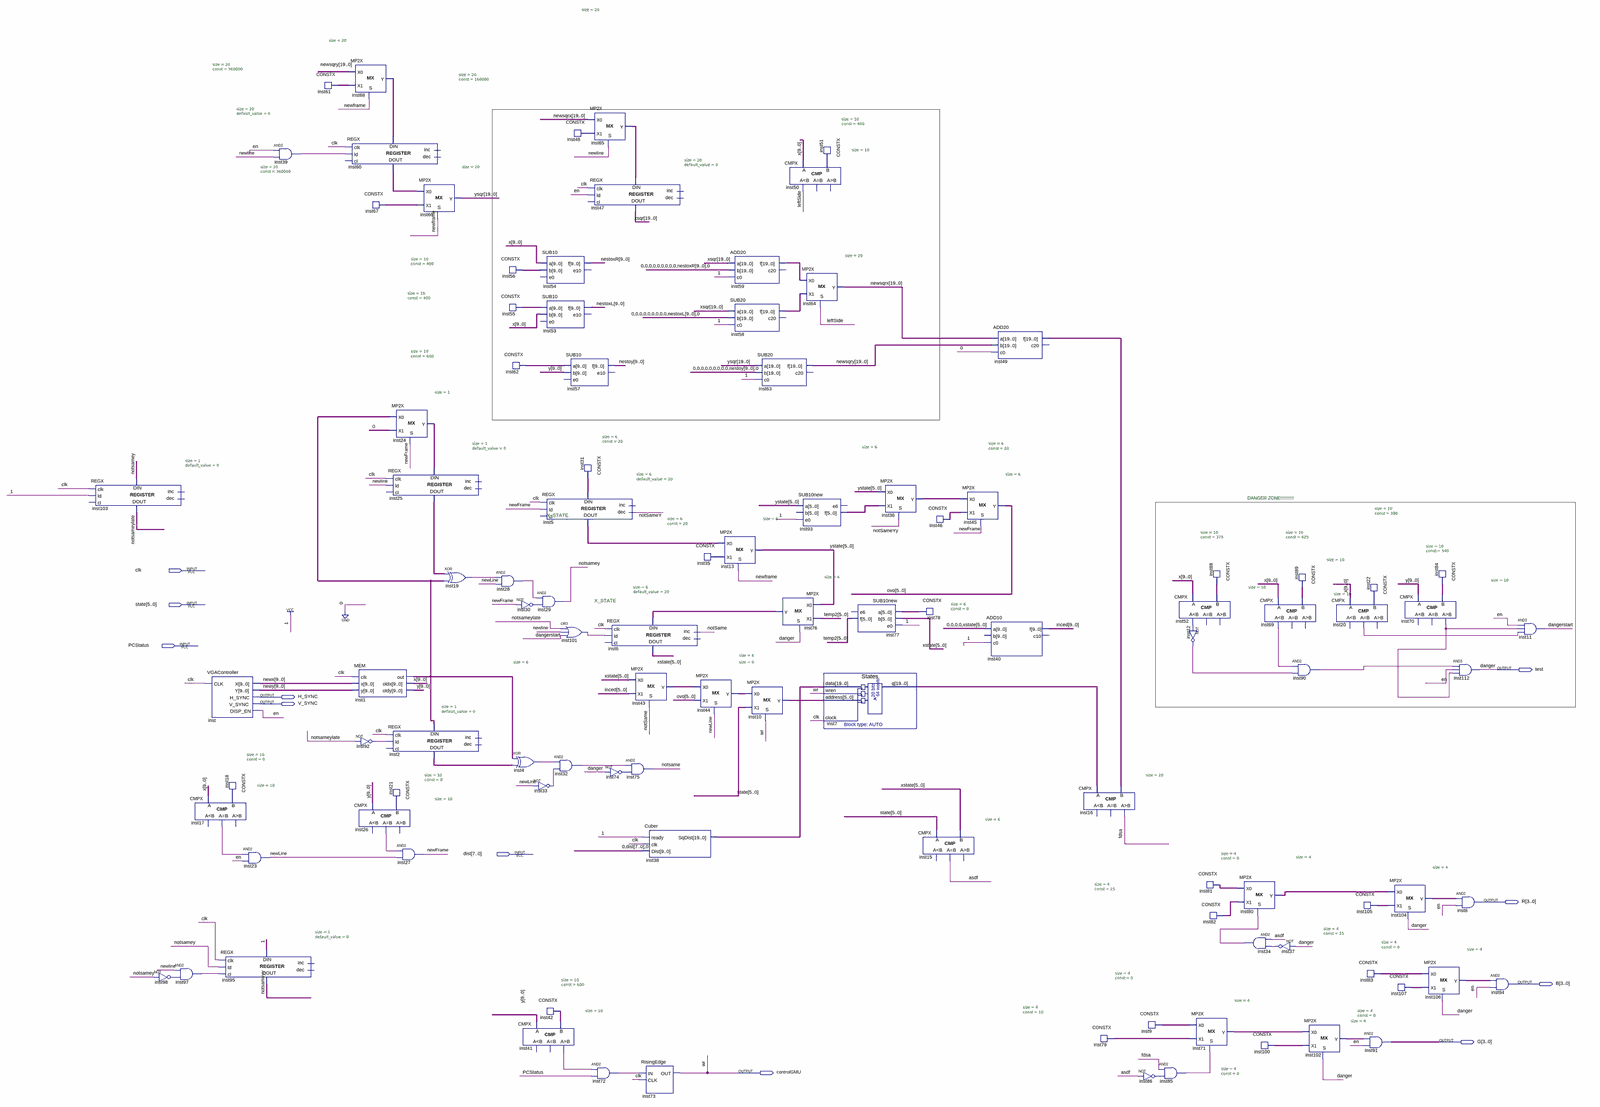
[diagram p0: schematic sheet, whole]
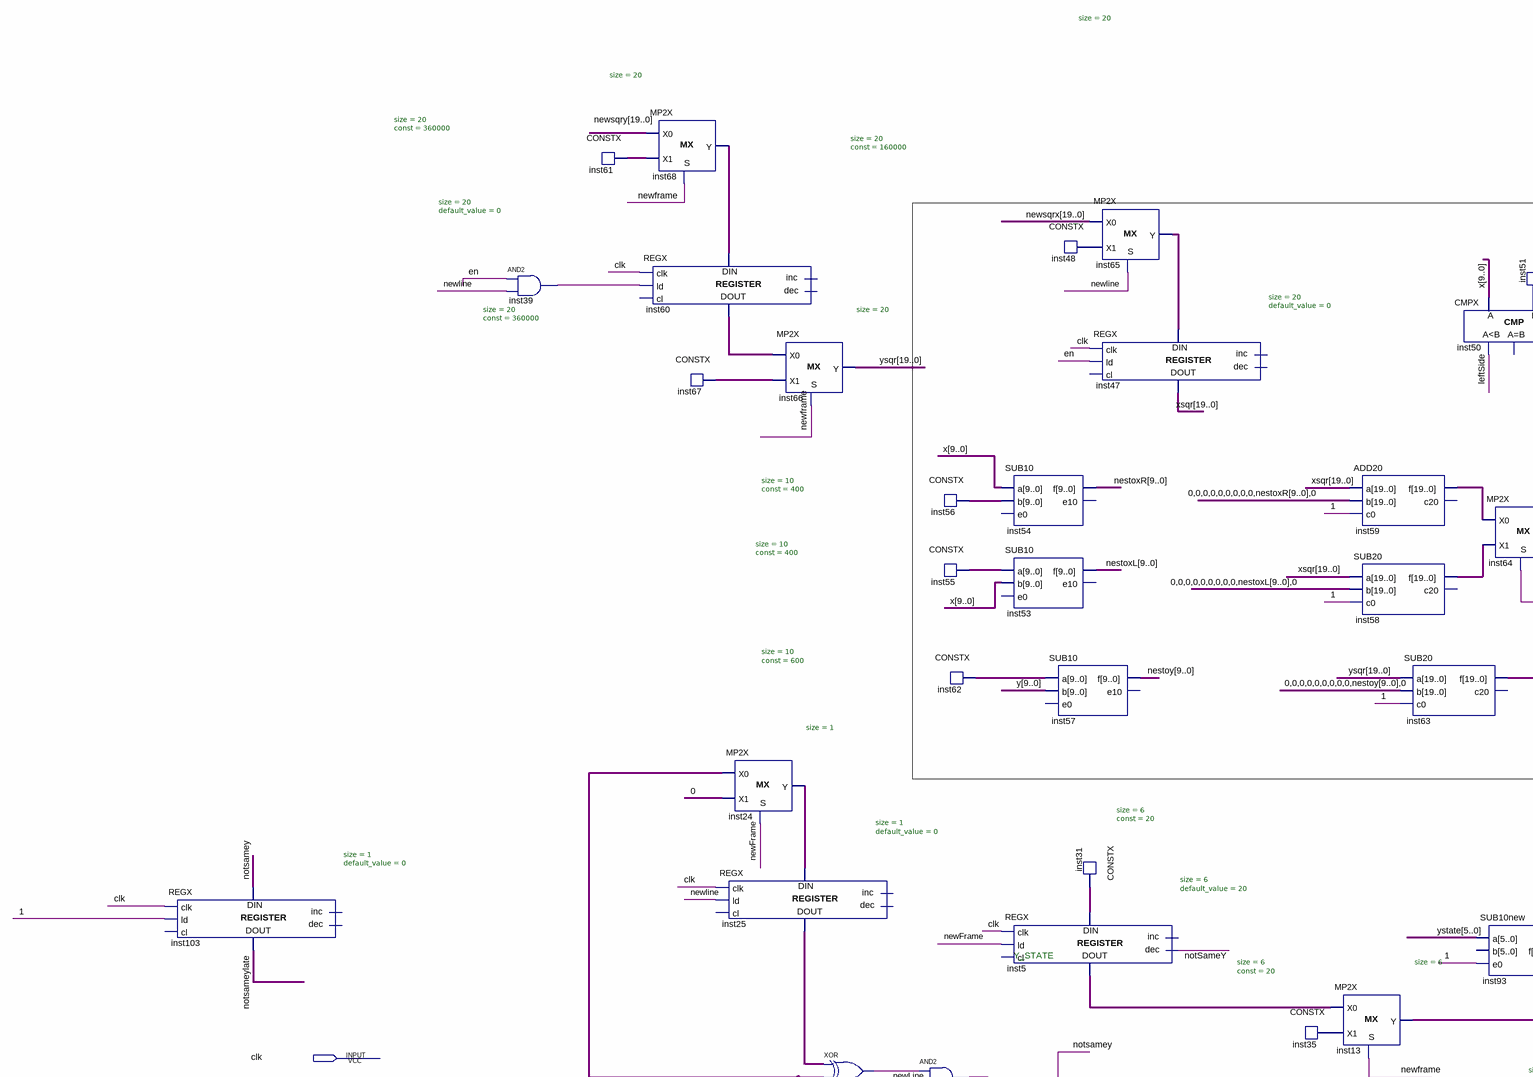
[diagram p1: schematic sheet, upper left part]
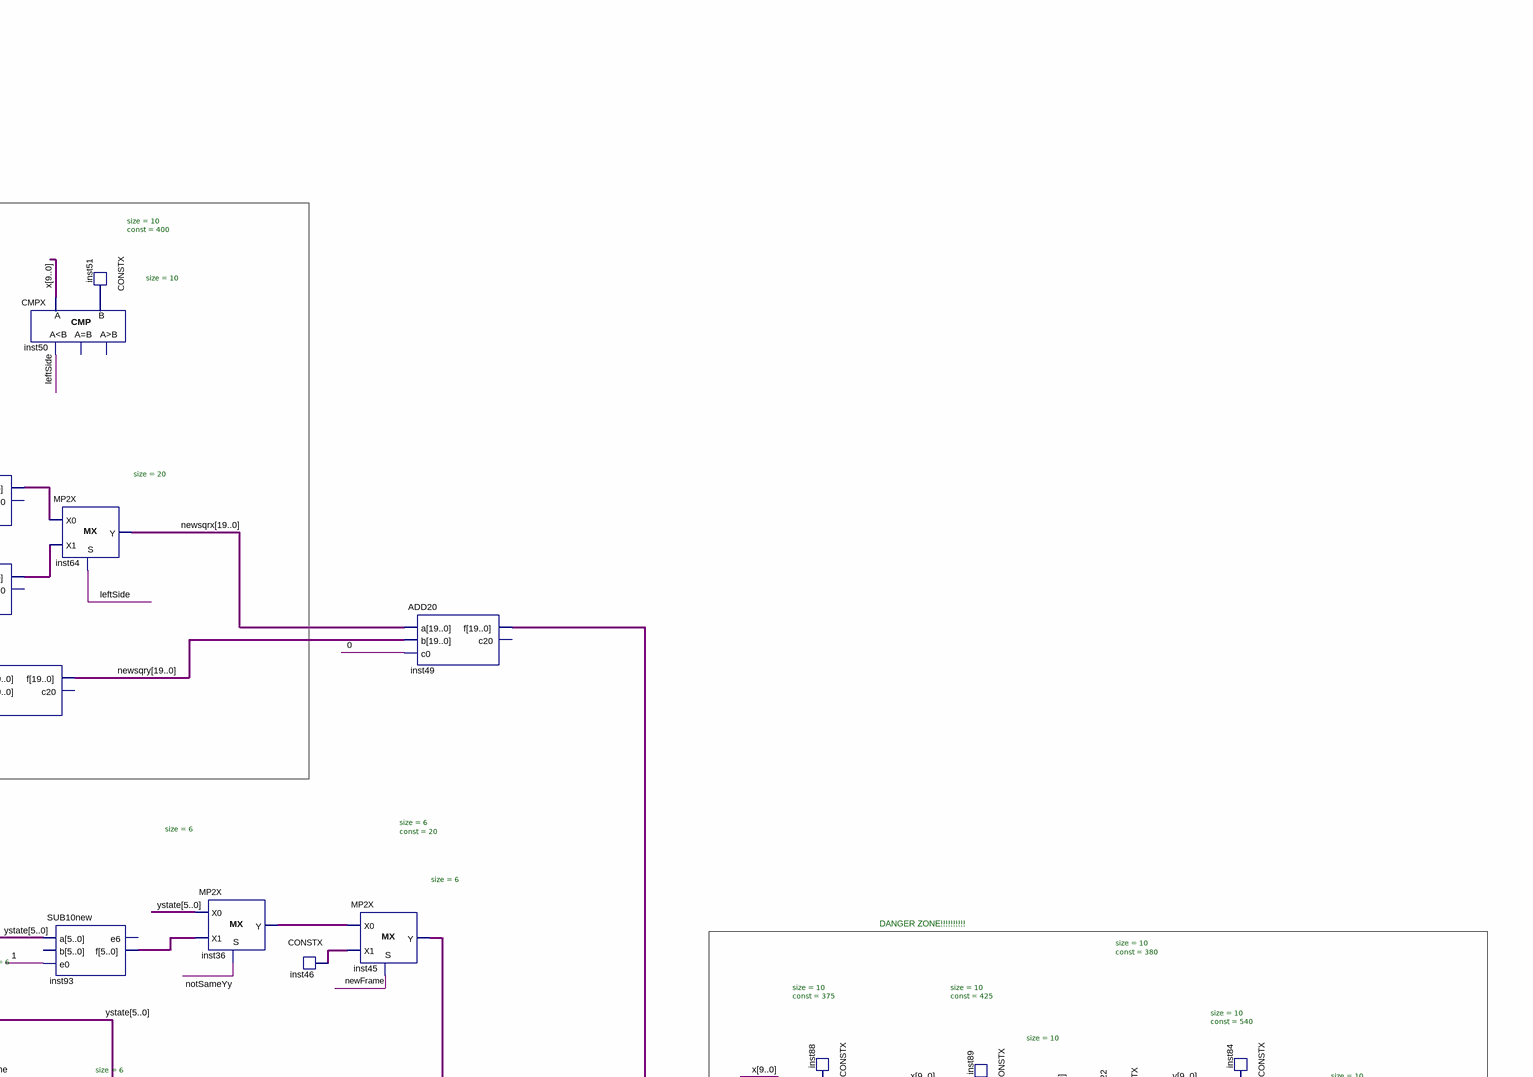
[diagram p2: schematic sheet, upper right part]
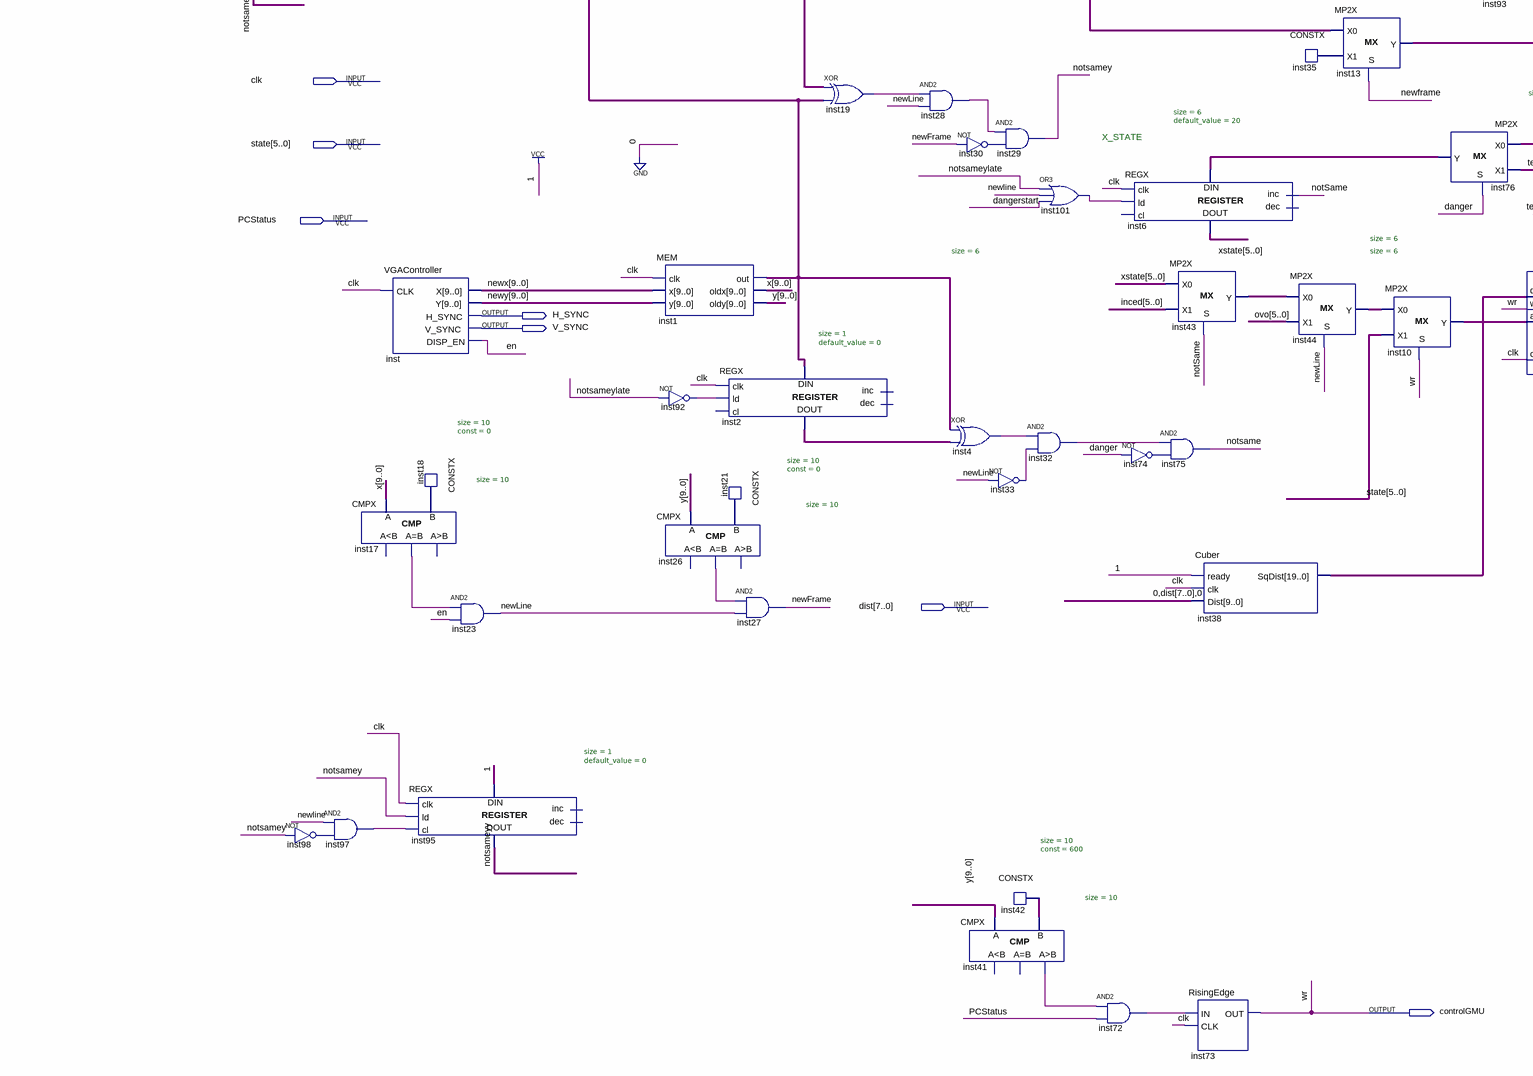
[diagram p3: schematic sheet, lower left part]
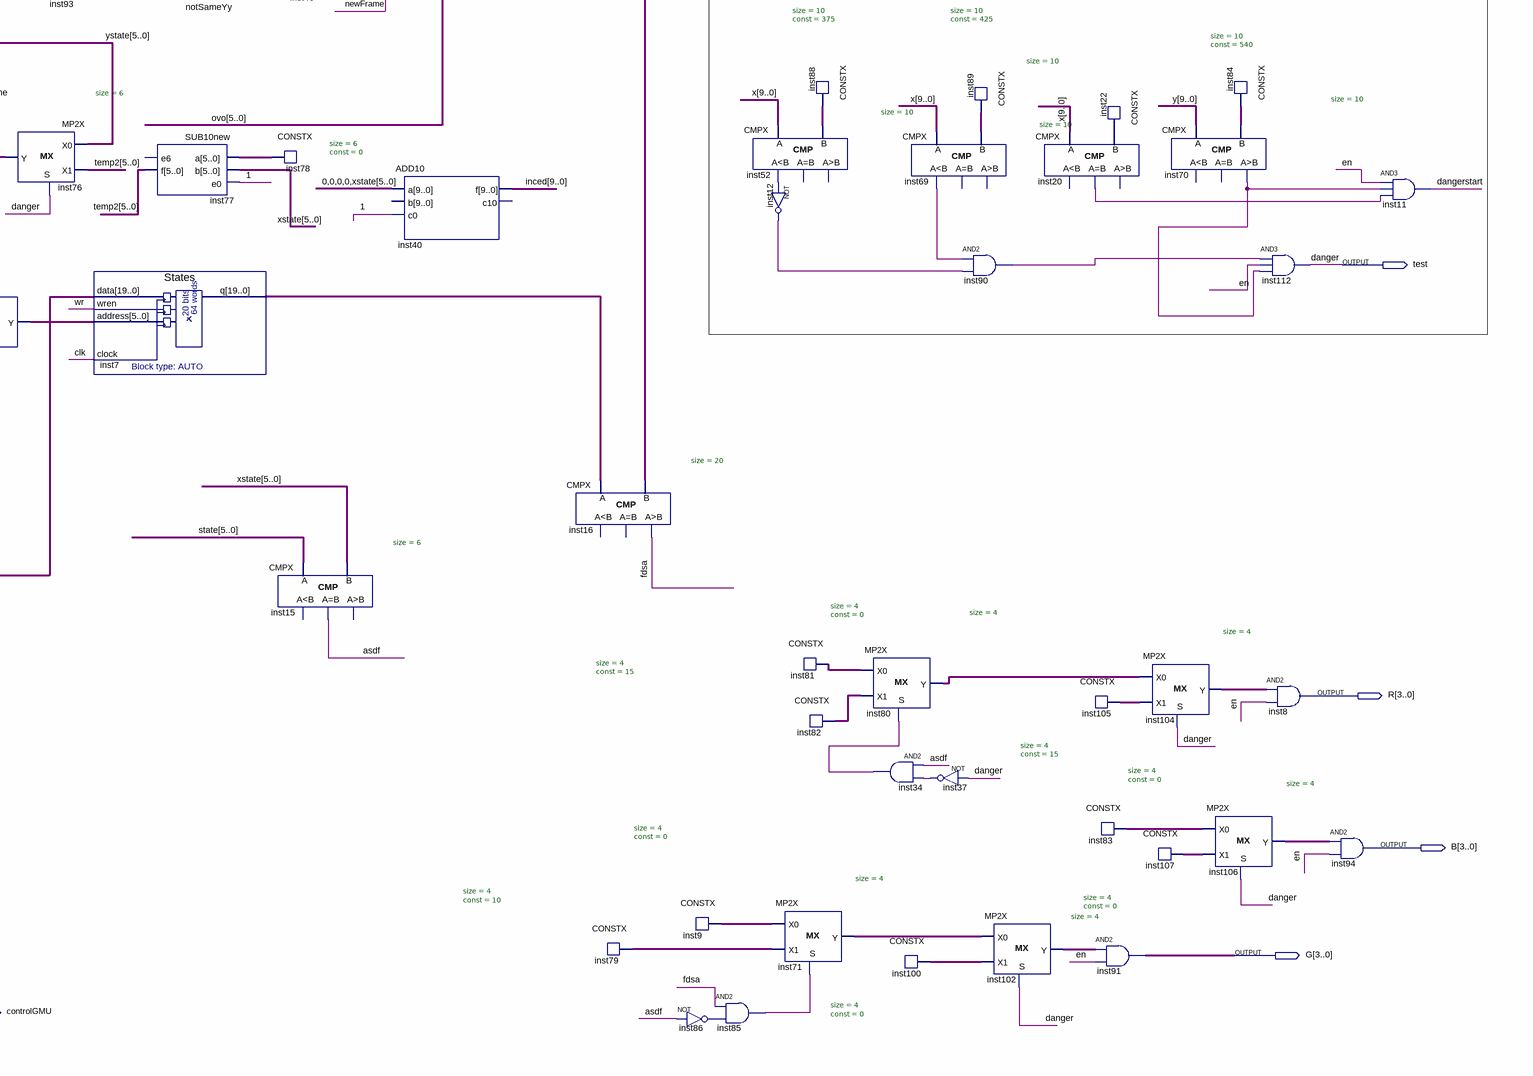
[diagram p4: schematic sheet, lower right part]
// Quartus schematic GMU.bdf as structural Verilog: 104 symbols, 11 pins
module GMU (
  input  clk,
  input  [5:0] state,
  input  PCStatus,
  input  [7:0] \dist ,
  output test,
  output H_SYNC,
  output V_SYNC,
  output [3:0] R,
  output [3:0] B,
  output [3:0] G,
  output controlGMU
);

  wire asdf, dangerstart, en, fdsa, inst1_out, inst2_data_out, inst4_out, inst12_out, inst17_eq, inst19_out,
       inst20_eq, inst24_y, inst25_data_out, inst26_eq, inst28_out, inst30_out, inst32_out, inst33_out,
       inst34_out, inst37_out, inst39_out, inst41_gr, inst52_ls, inst69_ls, inst70_gr, inst72_out,
       inst74_out, inst85_out, inst86_out, inst90_out, inst92_out, inst97_out, inst98_out, inst101_out,
       leftSide, newFrame, newLine, notsame, notsamey, notsameylate, notsameyy;
  wire [3:0] inst9_data, inst71_y, inst79_data, inst80_y, inst81_data, inst82_data, inst83_data,
       inst100_data, inst102_y, inst104_y, inst105_data, inst106_y, inst107_data;
  wire [5:0] inst5_data_out, inst10_y, inst31_data, inst35_data, inst36_y, inst43_y, inst44_y, inst46_data,
       inst76_y, inst78_data, inst93_f, ovo, temp2, xstate, ystate;
  wire [9:0] inced, inst18_data, inst21_data, inst22_data, inst42_data, inst51_data, inst55_data,
       inst56_data, inst62_data, inst84_data, inst88_data, inst89_data, nestoxL, nestoxR, nestoy, newx, newy,
       x, y;
  wire [19:0] inst7_q, inst38_sqdist, inst48_data, inst49_f, inst58_f, inst59_f, inst60_data_out,
       inst61_data, inst65_y, inst67_data, inst68_y, newsqrx, newsqry, xsqr, ysqr;

  REGX #(.size(1), .default_value(0)) inst103 (
    .clk(clk), .ld(1'b1), .data_in(notsamey), .data_out(notsameylate));  // open: cl, inc, dec
  and inst97 (inst97_out, newLine, inst98_out);
  not inst98 (inst98_out, notsamey);
  CMPX #(.size(10)) inst17 (.A(x), .B(inst18_data), .eq(inst17_eq));  // open: ls, gr
  VGAController inst (.CLK(clk), .X(newx), .Y(newy), .H_SYNC(H_SYNC), .V_SYNC(V_SYNC), .DISP_EN(en));
  CONSTX #(.size(10), .\const (0)) inst18 (.data(inst18_data));
  REGX #(.size(1), .default_value(0)) inst95 (
    .clk(clk), .ld(notsamey), .cl(inst97_out), .data_in(1'b1), .data_out(notsameyy));  // open: inc, dec
  and inst23 (newLine, inst17_eq, en);
  and inst39 (inst39_out, en, newLine);
  CONSTX #(.size(20), .\const (360000)) inst61 (.data(inst61_data));
  MP2X #(.size(20)) inst68 (.S(newFrame), .X0(newsqry), .X1(inst61_data), .Y(inst68_y));
  REGX #(.size(20), .default_value(0)) inst60 (
    .clk(clk), .ld(inst39_out), .data_in(inst68_y), .data_out(inst60_data_out));  // open: cl, inc, dec
  CONSTX #(.size(20), .\const (360000)) inst67 (.data(inst67_data));
  MEM inst1 (.clk(clk), .x(newx), .y(newy), .out(inst1_out), .oldx(x), .oldy(y));
  not inst92 (inst92_out, notsameylate);
  CMPX #(.size(10)) inst26 (.A(y), .B(inst21_data), .eq(inst26_eq));  // open: ls, gr
  MP2X #(.size(1)) inst24 (.S(newFrame), .X0(inst1_out), .X1(1'b0), .Y(inst24_y));
  REGX #(.size(1), .default_value(0)) inst25 (
    .clk(clk), .ld(newLine), .data_in(inst24_y), .data_out(inst25_data_out));  // open: cl, inc, dec
  REGX #(.size(1), .default_value(0)) inst2 (
    .clk(clk), .ld(inst92_out), .data_in(inst1_out), .data_out(inst2_data_out));  // open: cl, inc, dec
  CONSTX #(.size(10), .\const (0)) inst21 (.data(inst21_data));
  MP2X #(.size(20)) inst66 (.S(newFrame), .X0(inst60_data_out), .X1(inst67_data), .Y(ysqr));
  and inst27 (newFrame, inst26_eq, newLine);
  xor inst19 (inst19_out, inst25_data_out, inst1_out);
  CONSTX #(.size(10), .\const (400)) inst56 (.data(inst56_data));
  CONSTX #(.size(10), .\const (400)) inst55 (.data(inst55_data));
  CONSTX #(.size(10), .\const (600)) inst62 (.data(inst62_data));
  and inst28 (inst28_out, inst19_out, newLine);
  not inst30 (inst30_out, newFrame);
  xor inst4 (inst4_out, inst1_out, inst2_data_out);
  CMPX #(.size(10)) inst41 (.A(y), .B(inst42_data), .gr(inst41_gr));  // open: ls, eq
  SUB10 inst54 (.a(x), .b(inst56_data), .f(nestoxR));  // open: e0, e10
  SUB10 inst53 (.a(inst55_data), .b(x), .f(nestoxL));  // open: e0, e10
  REGX #(.size(6), .default_value(20)) inst5 (
    .clk(clk), .ld(newFrame), .dec(notsamey), .data_in(inst31_data), .data_out(inst5_data_out));  // open: cl, inc
  and inst29 (notsamey, inst28_out, inst30_out);
  and inst32 (inst32_out, inst4_out, inst33_out);
  not inst33 (inst33_out, newLine);
  CONSTX #(.size(10), .\const (600)) inst42 (.data(inst42_data));
  CONSTX #(.size(20), .\const (160000)) inst48 (.data(inst48_data));
  SUB10 inst57 (.a(inst62_data), .b(y), .f(nestoy));  // open: e0, e10
  CONSTX #(.size(6), .\const (20)) inst31 (.data(inst31_data));
  or inst101 (inst101_out, notsameylate, newLine, dangerstart);
  MP2X #(.size(20)) inst65 (.S(newLine), .X0(newsqrx), .X1(inst48_data), .Y(inst65_y));
  REGX #(.size(20), .default_value(0)) inst47 (
    .clk(clk), .ld(en), .data_in(inst65_y), .data_out(xsqr));  // open: cl, inc, dec
  REGX #(.size(6), .default_value(20)) inst6 (
    .clk(clk), .ld(inst101_out), .inc(notsame), .data_in(inst76_y), .data_out(xstate));  // open: cl, dec
  not inst74 (inst74_out, test);
  and inst72 (inst72_out, inst41_gr, PCStatus);
  MP2X #(.size(6)) inst43 (.S(notsame), .X0(xstate), .X1(inced[5:0]), .Y(inst43_y));
  and inst75 (notsame, inst32_out, inst74_out);
  RisingEdge inst73 (.IN(inst72_out), .CLK(clk), .OUT(controlGMU));
  Cuber inst38 (.ready(1'b1), .clk(clk), .Dist({1'b0, \dist , 1'b0}), .SqDist(inst38_sqdist));
  CONSTX #(.size(6), .\const (20)) inst35 (.data(inst35_data));
  MP2X #(.size(6)) inst44 (.S(newLine), .X0(inst43_y), .X1(ovo), .Y(inst44_y));
  MP2X #(.size(6)) inst13 (.S(newFrame), .X0(inst5_data_out), .X1(inst35_data), .Y(ystate));
  ADD20 inst59 (.a(xsqr), .b({{9{1'b0}}, nestoxR, 1'b0}), .c0(1'b1), .f(inst59_f));  // open: c20
  SUB20 inst58 (.a(xsqr), .b({{9{1'b0}}, nestoxL, 1'b0}), .c0(1'b1), .f(inst58_f));  // open: c20
  MP2X #(.size(6)) inst10 (.S(controlGMU), .X0(inst44_y), .X1(state), .Y(inst10_y));
  SUB20 inst63 (.a(ysqr), .b({{9{1'b0}}, nestoy, 1'b0}), .c0(1'b1), .f(newsqry));  // open: c20
  MP2X #(.size(6)) inst76 (.S(test), .X0(ystate), .X1(temp2), .Y(inst76_y));
  CMPX #(.size(10)) inst50 (.A(x), .B(inst51_data), .ls(leftSide));  // open: eq, gr
  MP2X #(.size(20)) inst64 (.S(leftSide), .X0(inst59_f), .X1(inst58_f), .Y(newsqrx));
  SUB10new inst93 (.a(ystate), .e0(1'b1), .f(inst93_f));  // open: b, e6
  CONSTX #(.size(10), .\const (400)) inst51 (.data(inst51_data));
  States inst7 (.data(inst38_sqdist), .wren(controlGMU), .address(inst10_y), .clock(clk), .q(inst7_q));
  SUB10new inst77 (.a(inst78_data), .b(xstate), .e0(1'b1), .f(temp2));  // open: e6
  MP2X #(.size(6)) inst36 (.S(notsameyy), .X0(ystate), .X1(inst93_f), .Y(inst36_y));
  CONSTX #(.size(6), .\const (20)) inst46 (.data(inst46_data));
  CONSTX #(.size(6), .\const (0)) inst78 (.data(inst78_data));
  CMPX #(.size(6)) inst15 (.A(state), .B(xstate), .eq(asdf));  // open: ls, gr
  MP2X #(.size(6)) inst45 (.S(newFrame), .X0(inst36_y), .X1(inst46_data), .Y(ovo));
  ADD20 inst49 (.a(newsqrx), .b(newsqry), .c0(1'b0), .f(inst49_f));  // open: c20
  ADD10 inst40 (.a({4'b0000, xstate}), .c0(1'b1), .f(inced));  // open: b, c10
  CMPX #(.size(20)) inst16 (.A(inst7_q), .B(inst49_f), .gr(fdsa));  // open: ls, eq
  CONSTX #(.size(4), .\const (10)) inst79 (.data(inst79_data));
  CONSTX #(.size(4), .\const (0)) inst9 (.data(inst9_data));
  and inst85 (inst85_out, fdsa, inst86_out);
  not inst86 (inst86_out, asdf);
  CMPX #(.size(10)) inst52 (.A(x), .B(inst88_data), .ls(inst52_ls));  // open: eq, gr
  not inst12 (inst12_out, inst52_ls);
  CONSTX #(.size(10), .\const (375)) inst88 (.data(inst88_data));
  CONSTX #(.size(4), .\const (0)) inst81 (.data(inst81_data));
  CONSTX #(.size(4), .\const (15)) inst82 (.data(inst82_data));
  MP2X #(.size(4)) inst71 (.S(inst85_out), .X0(inst9_data), .X1(inst79_data), .Y(inst71_y));
  MP2X #(.size(4)) inst80 (.S(inst34_out), .X0(inst81_data), .X1(inst82_data), .Y(inst80_y));
  CMPX #(.size(10)) inst69 (.A(x), .B(inst89_data), .ls(inst69_ls));  // open: eq, gr
  and inst34 (inst34_out, asdf, inst37_out);
  CONSTX #(.size(4), .\const (0)) inst100 (.data(inst100_data));
  CONSTX #(.size(10), .\const (425)) inst89 (.data(inst89_data));
  and inst90 (inst90_out, inst69_ls, inst12_out);
  not inst37 (inst37_out, test);
  MP2X #(.size(4)) inst102 (.S(test), .X0(inst71_y), .X1(inst100_data), .Y(inst102_y));
  CMPX #(.size(10)) inst20 (.A(x), .B(inst22_data), .eq(inst20_eq));  // open: ls, gr
  CONSTX #(.size(10), .\const (380)) inst22 (.data(inst22_data));
  CONSTX #(.size(4), .\const (15)) inst105 (.data(inst105_data));
  CONSTX #(.size(4), .\const (0)) inst83 (.data(inst83_data));
  assign G = inst102_y & {4{en}};  // AND2 inst91, 4 bits wide
  CMPX #(.size(10)) inst70 (.A(y), .B(inst84_data), .gr(inst70_gr));  // open: ls, eq
  MP2X #(.size(4)) inst104 (.S(test), .X0(inst80_y), .X1(inst105_data), .Y(inst104_y));
  CONSTX #(.size(4), .\const (0)) inst107 (.data(inst107_data));
  CONSTX #(.size(10), .\const (540)) inst84 (.data(inst84_data));
  MP2X #(.size(4)) inst106 (.S(test), .X0(inst83_data), .X1(inst107_data), .Y(inst106_y));
  and inst112 (test, inst90_out, en, inst70_gr);
  assign R = inst104_y & {4{en}};  // AND2 inst8, 4 bits wide
  assign B = inst106_y & {4{en}};  // AND2 inst94, 4 bits wide
  and inst11 (dangerstart, en, inst70_gr, inst20_eq);

  // Other names for the same wires on the sheet: danger = test; wr = controlGMU

  // Notes on the sheet:
  //   DANGER ZONE!!!!!!!!!!
  //   Y_STATE
  //   X_STATE
endmodule
